# EAGLE design stm32l100r_ucboard (EAGLE 9.6.2)
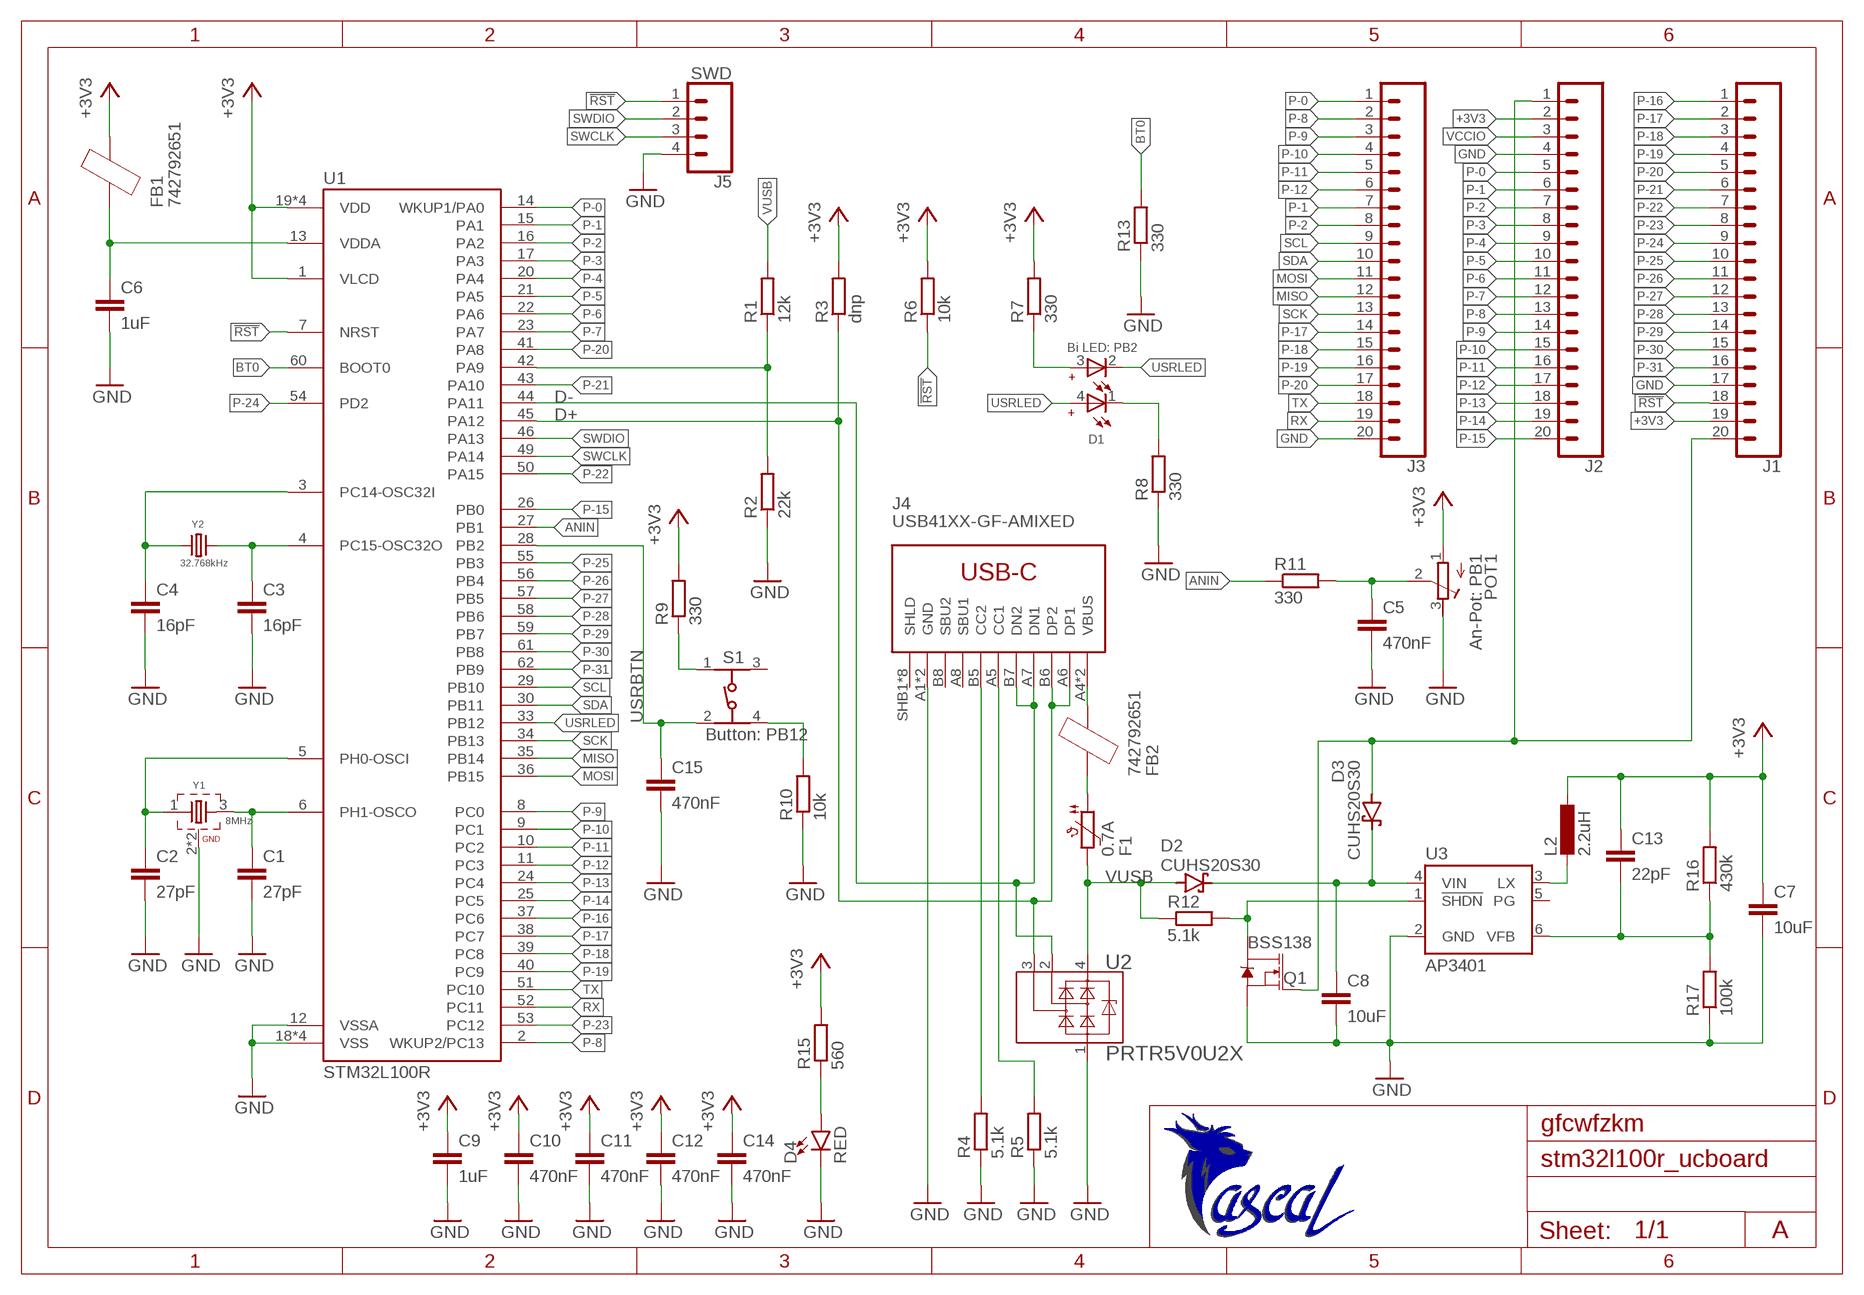
[diagram p0: schematic, sheet 1]

## Parts
C1  27pF  C-EUC0603  [C0603]
C2  27pF  C-EUC0603  [C0603]
C3  16pF  C-EUC0603  [C0603]
C4  16pF  C-EUC0603  [C0603]
C5  470nF  C-EUC0603  [C0603]
C6  1uF  C-EUC0603  [C0603]
C7  10uF  C-EUC0603  [C0603]
C8  10uF  C-EUC0603  [C0603]
C9  1uF  C-EUC0603  [C0603]
C10  470nF  C-EUC0603  [C0603]
C11  470nF  C-EUC0603  [C0603]
C12  470nF  C-EUC0603  [C0603]
C13  22pF  C-EUC0603  [C0603]
C14  470nF  C-EUC0603  [C0603]
C15  470nF  C-EUC0603  [C0603]
D1  Bi LED: PB2  WL-SBCD_0805_150080RV54050  [WL-SBCD_0805]
D2  CUHS20S30  [US2H]
D3  CUHS20S30  [US2H]
D4  RED  LED-RED0603  [LED-0603]
F1  0.7A  PTC_FUSE0805  [R0805]
FB1  742792651  FERRITE_BEAD  [R0603]
FB2  742792651  FERRITE_BEAD  [R0603]
J1  CONN_20  [1X20]
J2  CONN_20  [1X20]
J3  CONN_20  [1X20]
J4  USB41XX-GF-AMIXED  [USB4105-GF-A]
J5  SWD  CONN_04LOCK  [1X04_LOCK]
L2  2.2uH  L1210  [R1210]
POT1  An-Pot: PB1  RPOT-3386P  [3386P]
Q1  BSS138  MOSFET-NCH-BSS138  [SOT23-3]
R1  12k  R-EU_R0603  [R0603]
R2  22k  R-EU_R0603  [R0603]
R3  dnp  R-EU_R0603  [R0603]
R4  5.1k  R-EU_R0603  [R0603]
R5  5.1k  R-EU_R0603  [R0603]
R6  10k  R-EU_R0603  [R0603]
R7  330  R-EU_R0603  [R0603]
R8  330  R-EU_R0603  [R0603]
R9  330  R-EU_R0603  [R0603]
R10  10k  R-EU_R0603  [R0603]
R11  330  R-EU_R0603  [R0603]
R12  5.1k  R-EU_R0603  [R0603]
R13  330  R-EU_R0603  [R0603]
R15  560  R-EU_R0603  [R0603]
R16  430k  R-EU_R0603  [R0603]
R17  100k  R-EU_R0603  [R0603]
S1  Button: PB12  434153017835  [434153017835]
U1  STM32L100R  [LQFP-ST-64-2]
U2  PRTR5V0U2X  [SOT143B]
U3  AP3401  [TSOT23-6]
U$1  LOGO_PASCAL_GESELL10MM  [LOGO_10MM]
Y1  8MHz  WE-XTAL_CFPX-104_830106162701  [WE-XTAL_CFPX-104]
Y2  32.768kHz  WE-XTAL_CFPX-56_830025159  [WE-XTAL_CFPX-56]

## Nets
!RST: J1.18 J5.1 R6.1 U1.7(NRST)
!SHDN: Q1.3(D) R12.2 U3.1(!SHDN)
+3V3: C7.1 C9.1 C10.1 C11.1 C12.1 C13.1 C14.1 FB1.2 J1.19 J2.2 L2.1 POT1.1(A) R3.2 R6.2 R7.2 R9.2 R15.2 R16.2 U1.1(VLCD) U1.19(VDD) U1.32(VDD) U1.48(VDD) U1.64(VDD)
ANIN: R11.1 U1.27(PB1)
BT0: R13.2 U1.60(BOOT0)
D+: J4.A6(DP1) J4.B6(DP2) R3.1 U1.45(PA12) U2.3
D-: J4.A7(DN1) J4.B7(DN2) U1.44(PA11) U2.2
GND: C1.2 C2.2 C3.2 C4.2 C5.2 C6.2 C7.2 C8.2 C9.2 C10.2 C11.2 C12.2 C14.2 C15.2 D4.C J1.17 J2.4 J3.20 J4.A1(GND) J4.B1(GND) J5.4 POT1.3(E) Q1.2(S) R2.1 R4.1 R5.1 R8.1 R10.1 R13.1 R17.1 U1.12(VSSA) U1.18(VSS) U1.31(VSS) U1.47(VSS) U1.63(VSS) U2.1 U3.2(GND) Y1.2(GND) Y1.4(GND)
LX: L2.2 U3.3(LX)
MISO: J3.12 U1.35(PB14)
MOSI: J3.11 U1.36(PB15)
N$1: C4.1 U1.3(PC14-OSC32I) Y2.1
N$2: C3.1 U1.4(PC15-OSC32O) Y2.2
N$3: C2.1 U1.5(PH0-OSCI) Y1.1
N$4: C1.1 U1.6(PH1-OSCO) Y1.3
N$5: C6.1 FB1.1 U1.13(VDDA)
N$6: D1.3(G+) R7.1
N$7: J4.B5(CC2) R4.2
N$8: J4.A5(CC1) R5.2
N$9: F1.1 FB2.1
N$10: D1.1(R-) R8.2
N$11: R9.1 S1.1
N$12: R10.2 S1.4
N$14: C5.1 POT1.2(S) R11.2
N$19: D3.A J1.20 J2.1 Q1.1(G)
N$21: R1.1 R2.2 U1.42(PA9)
N$39: D4.A R15.1
P-0: J2.5 J3.1 U1.14(WKUP1/PA0)
P-1: J2.6 J3.7 U1.15(PA1)
P-2: J2.7 J3.8 U1.16(PA2)
P-3: J2.8 U1.17(PA3)
P-4: J2.9 U1.20(PA4)
P-5: J2.10 U1.21(PA5)
P-6: J2.11 U1.22(PA6)
P-7: J2.12 U1.23(PA7)
P-8: J2.13 J3.2 U1.2(WKUP2/PC13)
P-9: J2.14 J3.3 U1.8(PC0)
P-10: J2.15 J3.4 U1.9(PC1)
P-11: J2.16 J3.5 U1.10(PC2)
P-12: J2.17 J3.6 U1.11(PC3)
P-13: J2.18 U1.24(PC4)
P-14: J2.19 U1.25(PC5)
P-15: J2.20 U1.26(PB0)
P-16: J1.1 U1.37(PC6)
P-17: J1.2 J3.14 U1.38(PC7)
P-18: J1.3 J3.15 U1.39(PC8)
P-19: J1.4 J3.16 U1.40(PC9)
P-20: J1.5 J3.17 U1.41(PA8)
P-21: J1.6 U1.43(PA10)
P-22: J1.7 U1.50(PA15)
P-23: J1.8 U1.53(PC12)
P-24: J1.9 U1.54(PD2)
P-25: J1.10 U1.55(PB3)
P-26: J1.11 U1.56(PB4)
P-27: J1.12 U1.57(PB5)
P-28: J1.13 U1.58(PB6)
P-29: J1.14 U1.59(PB7)
P-30: J1.15 U1.61(PB8)
P-31: J1.16 U1.62(PB9)
RX: J3.19 U1.52(PC11)
SCK: J3.13 U1.34(PB13)
SCL: J3.9 U1.29(PB10)
SDA: J3.10 U1.30(PB11)
SWCLK: J5.3 U1.49(PA14)
SWDIO: J5.2 U1.46(PA13)
TX: J3.18 U1.51(PC10)
USRBTN: C15.1 S1.2 U1.28(PB2)
USRLED: D1.2(G-) D1.4(R+) U1.33(PB12)
VBUS: FB2.2 J4.A4(VBUS) J4.B4(VBUS)
VCCIO: J2.3
VFB: C13.2 R16.1 R17.2 U3.6(VFB)
VIN: C8.1 D2.C D3.C U3.4(VIN)
VUSB: D2.A F1.2 R1.2 R12.1 U2.4
Unconnected: J4.A8(SBU1) J4.B8(SBU2) J4.SHB1(SHLD) J4.SHB2(SHLD) J4.SHB3(SHLD) J4.SHB4(SHLD) J4.SHT1(SHLD) J4.SHT2(SHLD) J4.SHT3(SHLD) J4.SHT4(SHLD) S1.3 U3.5(PG)

## Notes on the sheet
- gfcwfzkm
- A

## Library data of the parts
C1-C15 = rcl:C-EU: CAPACITOR, European symbol; SPICEPREFIX: C
D1 = Wurth_LEDs_WL-SBCD:WL-SBCD_0805: WL-SBCD SMD Bi-color Chip LED Diffused Characteristics Two chips in one package Diffused lens Industry standard footprint High efficiency Low power consumption Wide viewing angle Thin, 0.5 mm height Packaged in standard tape and reel 7" Compatible with automatic placement machine Applications Backlighting applications Status indicator Front panel indicators Push button backlighting Symbol and switch backlighting <https://www.we-online.com/catalog/media/o165027v209%20Family_WL-SBCD_0805_150080xx54050.jpg> Details see: https://www.we-online.com/catalog/en/WL-SBCD/ Updated By Yingchun,Shan 2020-03-18 2020(C) Wurth Elektronik; ABSTRAHLWINKEL: 130°; DATASHEET-URL: https://www.we-online.com/catalog/datasheet/150080RV54050.pdf; EMITTING-COLOR: Red & Bright Green; PART-NUMBER: 150080RV54050
D2 D3 = Elektroniker MGB:CUHS: CUHSxx High Speed Schottky Barrier Diode Series With a Very Low Vf Voltage CUHS15F40 <https://toshiba.semicon-storage.com/info/docget.jsp?did=63603&prodName=CUHS15F40>, CUHS20S30 <https://toshiba.semicon-storage.com/info/docget.jsp?did=63606&prodName=CUHS20S30>, CUHS20S40 <https://toshiba.semicon-storage.com/info/docget.jsp?did=63610&prodName=CUHS20S40>, CUHS20F30 <https://toshiba.semicon-storage.com/info/docget.jsp?did=63604&prodName=CUHS20F30>, CUHS20F40 <https://toshiba.semicon-storage.com/info/docget.jsp?did=63600&prodName=CUHS20F40>
D4 = SparkFun-LED:LED-RED: Red SMD LED Used in manufacturing of most products at SparkFun Packages: 0603 - SMD 0603 package [Product Link] <http://docs.avagotech.com/docs/AV02-0551EN> 0603 SMART - SMD 0603 SMART package ( more efficient and expensive)[Product Link] <http://www.osram-os.com/Graphics/XPic2/00077099_0.pdf> 1206 - SMD1206 package [Product Link] <https://www.sparkfun.com/datasheets/DevTools/LilyPad/Q150OVS4.pdff> SparkFun Products: Pro Mini 328 -5V <https://www.sparkfun.com/products/821> RedBoard <https://www.sparkfun.com/products/12757> IOIO-OTG <https://www.sparkfun.com/products/13613>; PROD_ID: DIO-00819
F1 = Elektroniker MGB:PTC_FUSE
FB1 FB2 = Elektroniker MGB:FERRITE_BEAD
J1-J3 = SparkFun-Connectors:CONN_20: Multi connection point. Often used as Generic Header-pin footprint for 0.1 inch spaced/style header connections On any of the 0.1 inch spaced packages, you can populate with these: Break Away Headers - Straight <https://www.sparkfun.com/products/116> (PRT-00116) Break Away Male Headers - Right Angle <https://www.sparkfun.com/products/553> (PRT-00553) Female Headers <https://www.sparkfun.com/products/115> (PRT-00115) Break Away Headers - Machine Pin <https://www.sparkfun.com/products/117> (PRT-00117) Break Away Female Headers - Swiss Machine Pin <https://www.sparkfun.com/products/743> (PRT-00743) For SCREWTERMINALS and SPRING TERMINALS visit here: Screw Terimnals on SparkFun.com <https://www.sparkfun.com/search/results?term=Screw+Terminals> (5mm/3.5mm/2.54mm spacing) This device is also useful as a general connection point to wire up your design to another part of your project. Our various solder wires solder well into these plated through hole pads. Hook-Up Wire - Assortment (Stranded, 22 AWG) <https://www.sparkfun.com/products/11375> (PRT-11375) Hook-Up Wire - Assortment (Solid Core, 22 AWG) <https://www.sparkfun.com/products/11367> (PRT-11367) View the entire wire category on our website here <https://www.sparkfun.com/categories/141> Special notes: Molex polarized connector foot print use with SKU : PRT-08231 with associated crimp pins and housings. 1MM SMD Version SKU: PRT-10208 NOTES ON THE VARIANTS LOCK and LOCK_LONGPADS... This footprint was designed to help hold the alignment of a through-hole component (i.e. 6-pin header) while soldering it into place. You may notice that each hole has been shifted either up or down by 0.005 of an inch from it's more standard position (which is a perfectly straight line). This slight alteration caused the pins (the squares in the middle) to touch the edges of the holes. Because they are alternating, it causes a "brace" to hold the component in place. 0.005 has proven to be the perfect amount of "off-center" position when using our standard breakaway headers. Although looks a little odd when you look at the bare footprint, once you have a header in there, the alteration is very hard to notice. Also,if you push a header all the way into place, it is covered up entirely on the bottom side. Note about LOCK SPECIAL package: This is just like the LOCK variant in that the holes are staggared by 5 mil, but except for the last two holes. They are not altered from the "standard" footprint layout. This is used for a special purpose on the layout of our Graphic LCD Backpack. Make sure you want to use this device before selecting it for you project!
J4 = Pascal_Library:USB41XX-GF-A
J5 = SparkFun-Connectors:CONN_04: Multi connection point. Often used as Generic Header-pin footprint for 0.1 inch spaced/style header connections On any of the 0.1 inch spaced packages, you can populate with these: Break Away Headers - Straight <https://www.sparkfun.com/products/116> (PRT-00116) Break Away Male Headers - Right Angle <https://www.sparkfun.com/products/553> (PRT-00553) Female Headers <https://www.sparkfun.com/products/115> (PRT-00115) Break Away Headers - Machine Pin <https://www.sparkfun.com/products/117> (PRT-00117) Break Away Female Headers - Swiss Machine Pin <https://www.sparkfun.com/products/743> (PRT-00743) For SCREWTERMINALS and SPRING TERMINALS visit here: Screw Terimnals on SparkFun.com <https://www.sparkfun.com/search/results?term=Screw+Terminals> (5mm/3.5mm/2.54mm spacing) This device is also useful as a general connection point to wire up your design to another part of your project. Our various solder wires solder well into these plated through hole pads. Hook-Up Wire - Assortment (Stranded, 22 AWG) <https://www.sparkfun.com/products/11375> (PRT-11375) Hook-Up Wire - Assortment (Solid Core, 22 AWG) <https://www.sparkfun.com/products/11367> (PRT-11367) View the entire wire category on our website here <https://www.sparkfun.com/categories/141> Special notes: Molex polarized connector foot print use with SKU : PRT-08231 with associated crimp pins and housings. 1MM SMD Version SKU: PRT-10208; PROD_ID: CONN-09696
L2 = Pascal_Library:L
POT1 = Pascal_Library:RPOT-3386P
Q1 = SparkFun-DiscreteSemi:MOSFET-NCH: N-channel MOSFETs Voltage controlled devices that allow control of high current outputs. SparkFun Products: SparkFun OpenScale <https://www.sparkfun.com/products/13261> SparkFun Digital Sandbox <https://www.sparkfun.com/products/12651> SparkFun Monster Moto Shield <https://www.sparkfun.com/products/10182> SparkFun MOSFET Power Controller <https://www.sparkfun.com/products/11214>; PROD_ID: TRANS-00830; VALUE: 220mA/50V/3.5Ω
R1-R13 R15-R17 = rcl:R-EU_: RESISTOR, European symbol; SPICEPREFIX: R
S1 = Wurth_Switch_WS-TASV:434153017835: WS-TASV J-Bend SMT Tact Switch 3.5x2.9 mm Material Properties Cover Material : Stainless Steel Properties Actuator Material:LCP Actuator Flammability Rating:UL94 V-0 Actuator Color:Blue Frame Material:PA46 Frame Flammability Rating:UL94 HB Frame Color:Black Contact Material:Stainless Steel Contact Plating:Silver Terminal Material:Copper Alloy Terminal Plating:Silver VR:12 V (DC) Contact Resistance Initial:100 mΩ Contact Resistance After Life Test:1 Ω RISO:100 MΩ Withstanding Voltage:250 V (AC) Washable:No Qty.:4000 Mechanical Properties Stroke :0.15 mm General Information Operating Temperature:-40 up to +85 °C Washable:No Packaging Properties Packaging:Tape and Reel <https://www.we-online.com/catalog/media/o72753v209%20WS-TASU_434331013822_a_4C.jpg> Details see: https://www.we-online.com/catalog/en/TASV_3_5X2_9_SMD_J-BEND/ Updated by yingchun,Shan;2020-02-18 2020(C) Würth Elektronik; DATASHEET-URL: https://www.we-online.com/catalog/datasheet/434153017835.pdf; H: 1.7mm; OPERATION-FORCE: 350g; PART-NUMBER: 434153017835; QTY: 4000; VALUE: 434153017835
U1 = Pascal_Library:STM32L100R
U2 = Elektroniker MGB:PRTR5V0U2X: PRTR5V0U2X - Ultra low capacitance double rail-to-rail ESD protection diode Ultra low capacitance rail-to-rail ElectroStatic Discharge (ESD) protection diode in a small SOT143B Surface-Mounted Device (SMD) plastic package designed to protect two Hi-Speed data lines or high-frequency signal lines from the damage caused by ESD and other transients. PRTR5V0U2X incorporates two pairs of ultra low capacitance rail-to-rail diodes as well as an additional ESD protection diode to ensure signal line protection even if no supply voltage is available.
U3 = Pascal_Library:AP3401
U$1 = Pascal_Library:LOGO_PASCAL_GESELL: Mein Logo halt
Y1 = Wurth_Quartz Crystals & Oscillators_WE-XTAL:WE-XTAL_CFPX-104: WE-XTAL Quartz Crystal Characteristics SMT and THT models Hermetically sealed Frequencies between 1.8432 MHz and 50 MHz Tolerances down to ±10 ppm available Maximum operating temperatures range: -40 °C to 85 °C Stabilities down to ±10 ppm available Applications Microprocessor Wireless Communication Devices Industrial Devices Wired Communication (e.g. Ethernet and USB) IoT Optical Network Audio and Multimedia Devices Test and Measurement Equipment Navigation and Locators Wearables <https://www.we-online.com/catalog/media/o135919v209%20Family_WE-XTAL_IQXC-42.jpg> Details see: https://www.we-online.com/catalog/en/WE-XTAL Updated by Ella Wu , 2020-11-23 2020 (C) Wurth Elektronik; C-LOAD: 16pF; DATASHEET-URL: https://www.we-online.com/catalog/datasheet/830106162701.pdf; MOUNT: SMT; PART-NUMBER: 830106162701; STABILITY: 30ppm; TOLERANCE: ±20ppm
Y2 = Wurth_Quartz Crystals & Oscillators_WE-XTAL:WE-XTAL_CFPX-56: WE-XTAL Watch Crystals Characteristics SMT and THT models Hermetically sealed Frequency: 32.768 kHz Tolerances down to ±10 ppm available Characteristics Microprocessor Real Time Clocks Test and Measurement Equipment Battery powered Applications <https://www.we-online.com/catalog/media/o162740v209%20Family_WE-XTAL_WatchCrystal.jpg> Details see: https://www.we-online.com/catalog/en/WE-XTAL_WATCHCRYSTAL Updated by Ella Wu, 2020-10-30 2020 (C) Wurth Elektronik; C-LOAD: 12.5pF; DATASHEET-URL: https://www.we-online.com/catalog/datasheet/830025159.pdf; MOUNT: SMT; PART-NUMBER: 830025159; TOLERANCE: ±20ppm

## Board
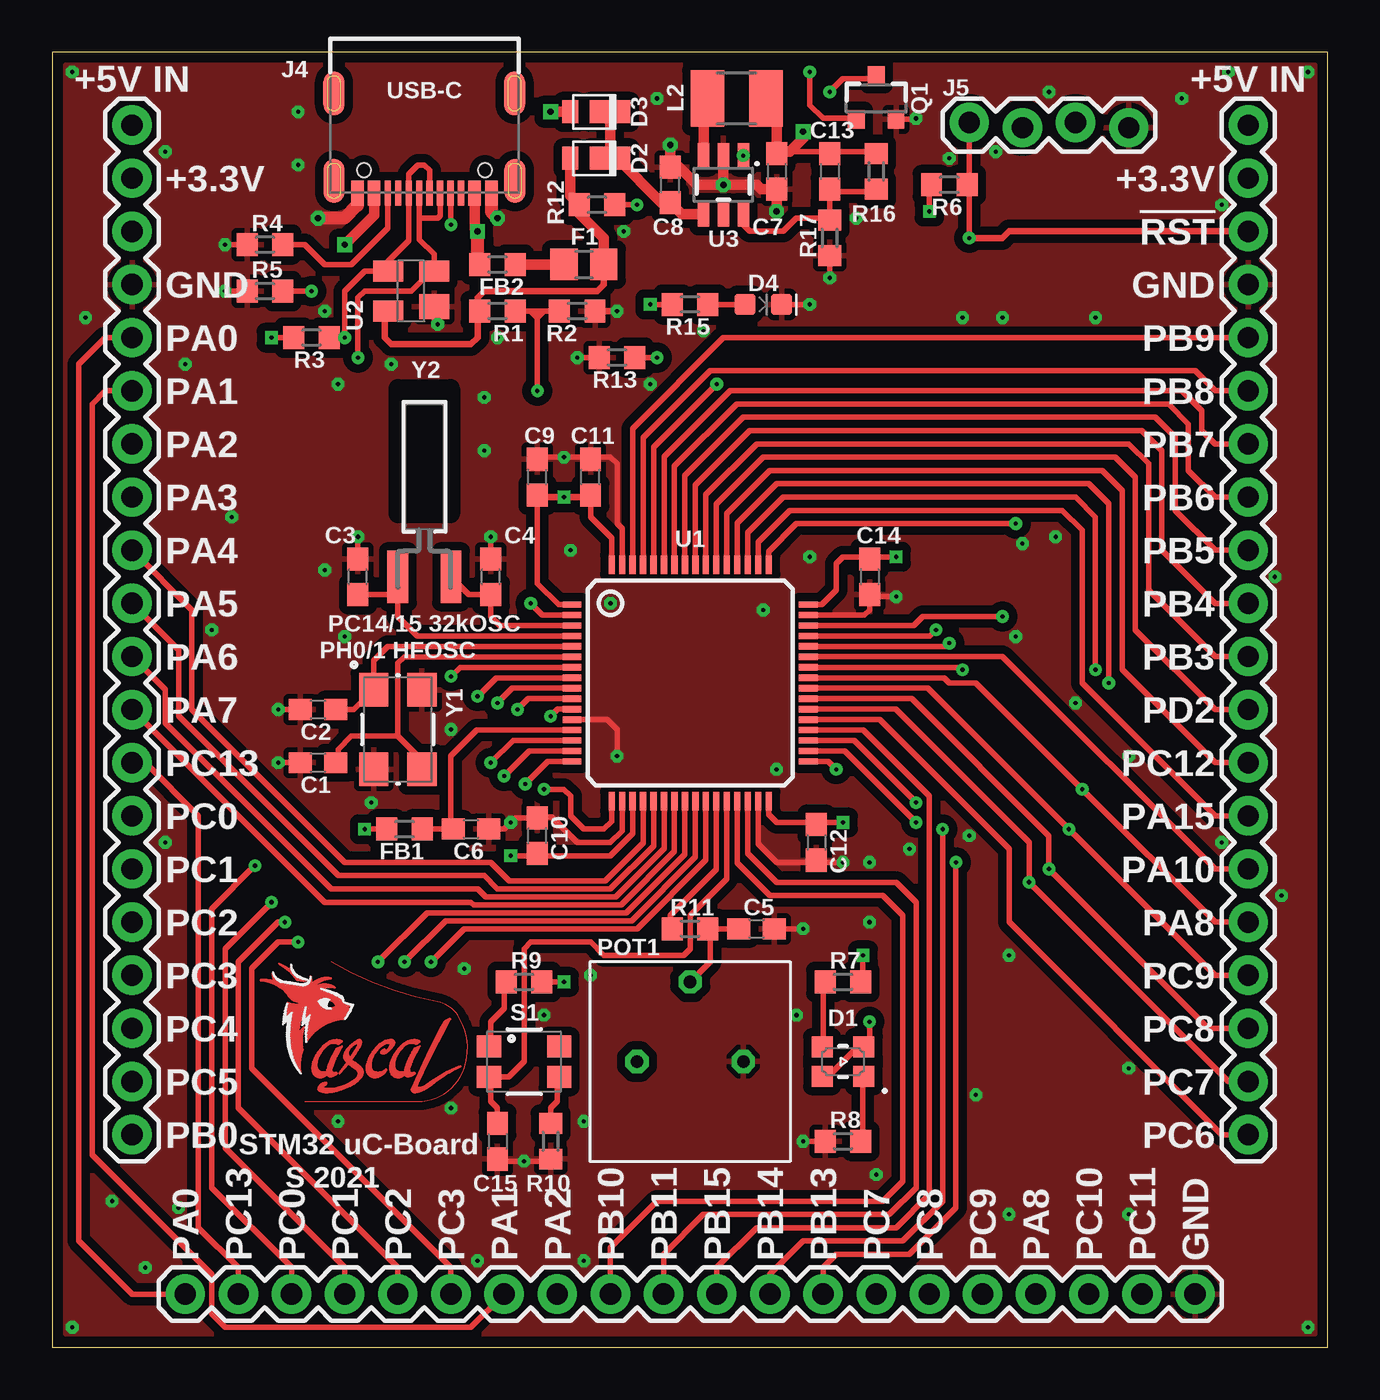
[diagram p1: board, top side]
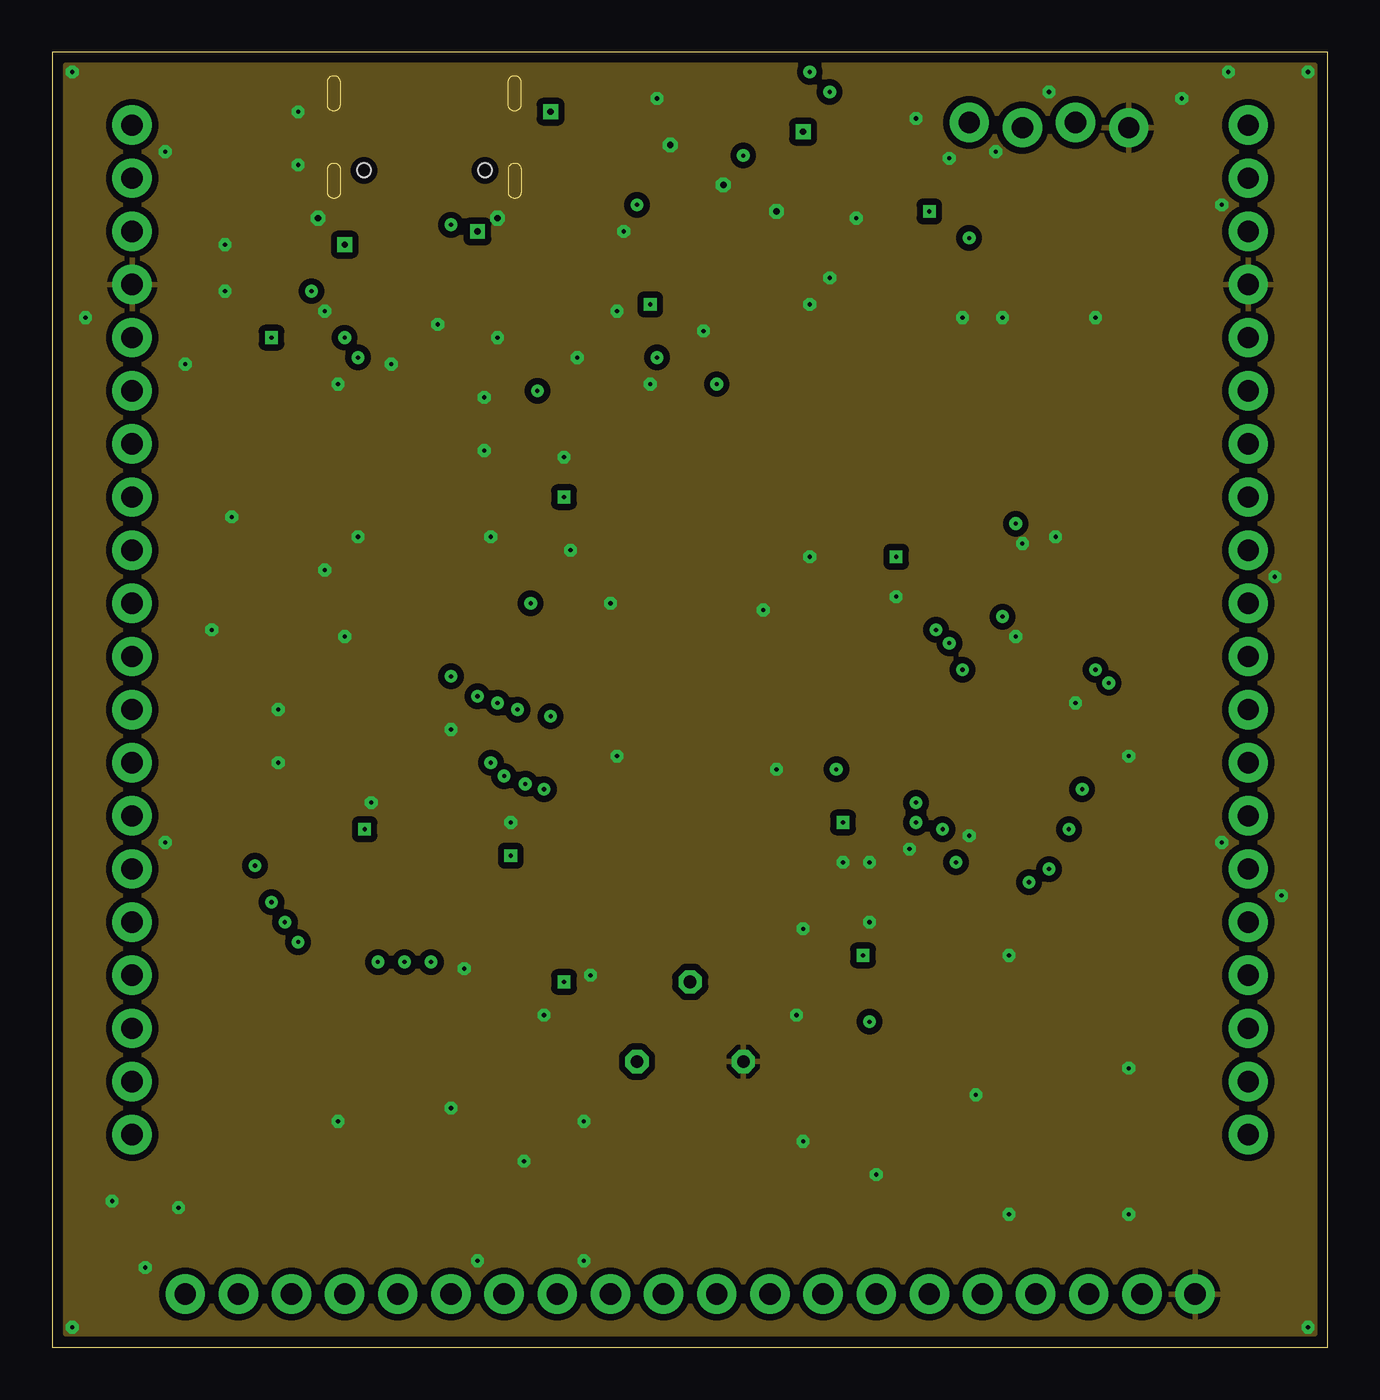
[diagram p2: board, inner layer Route2]
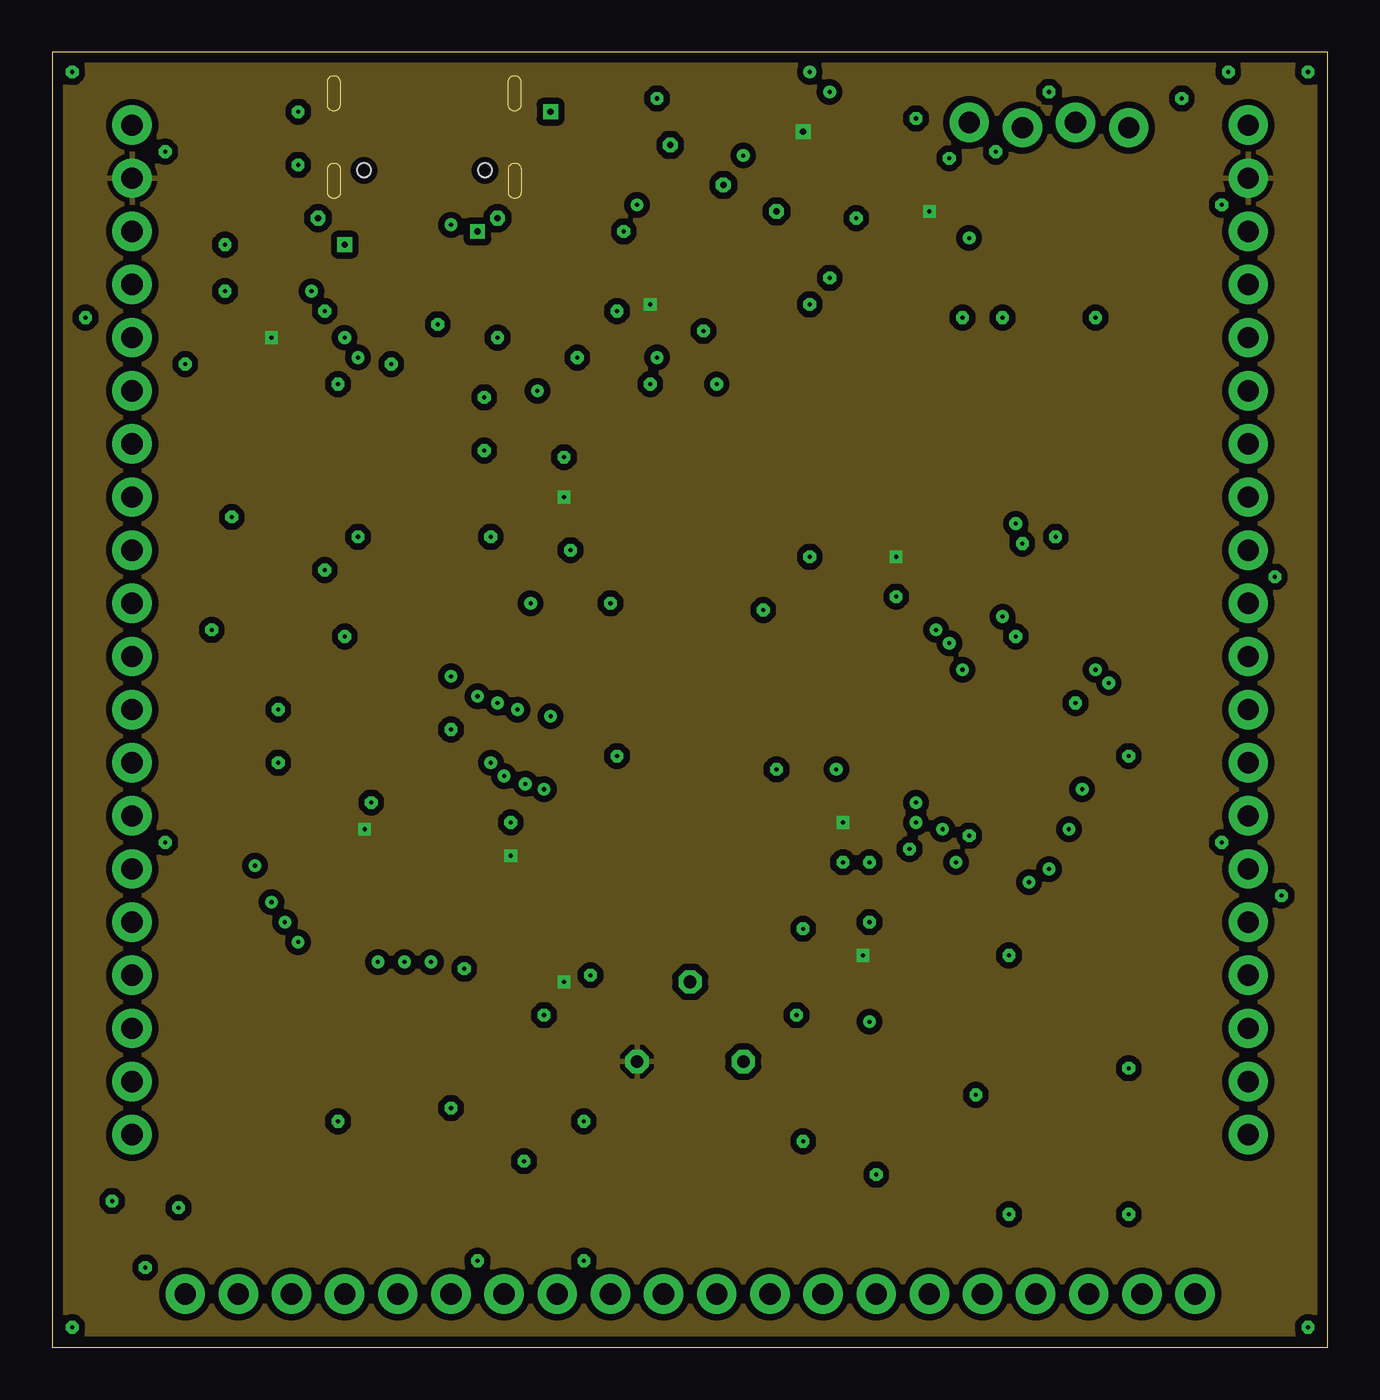
[diagram p3: board, inner layer Route15]
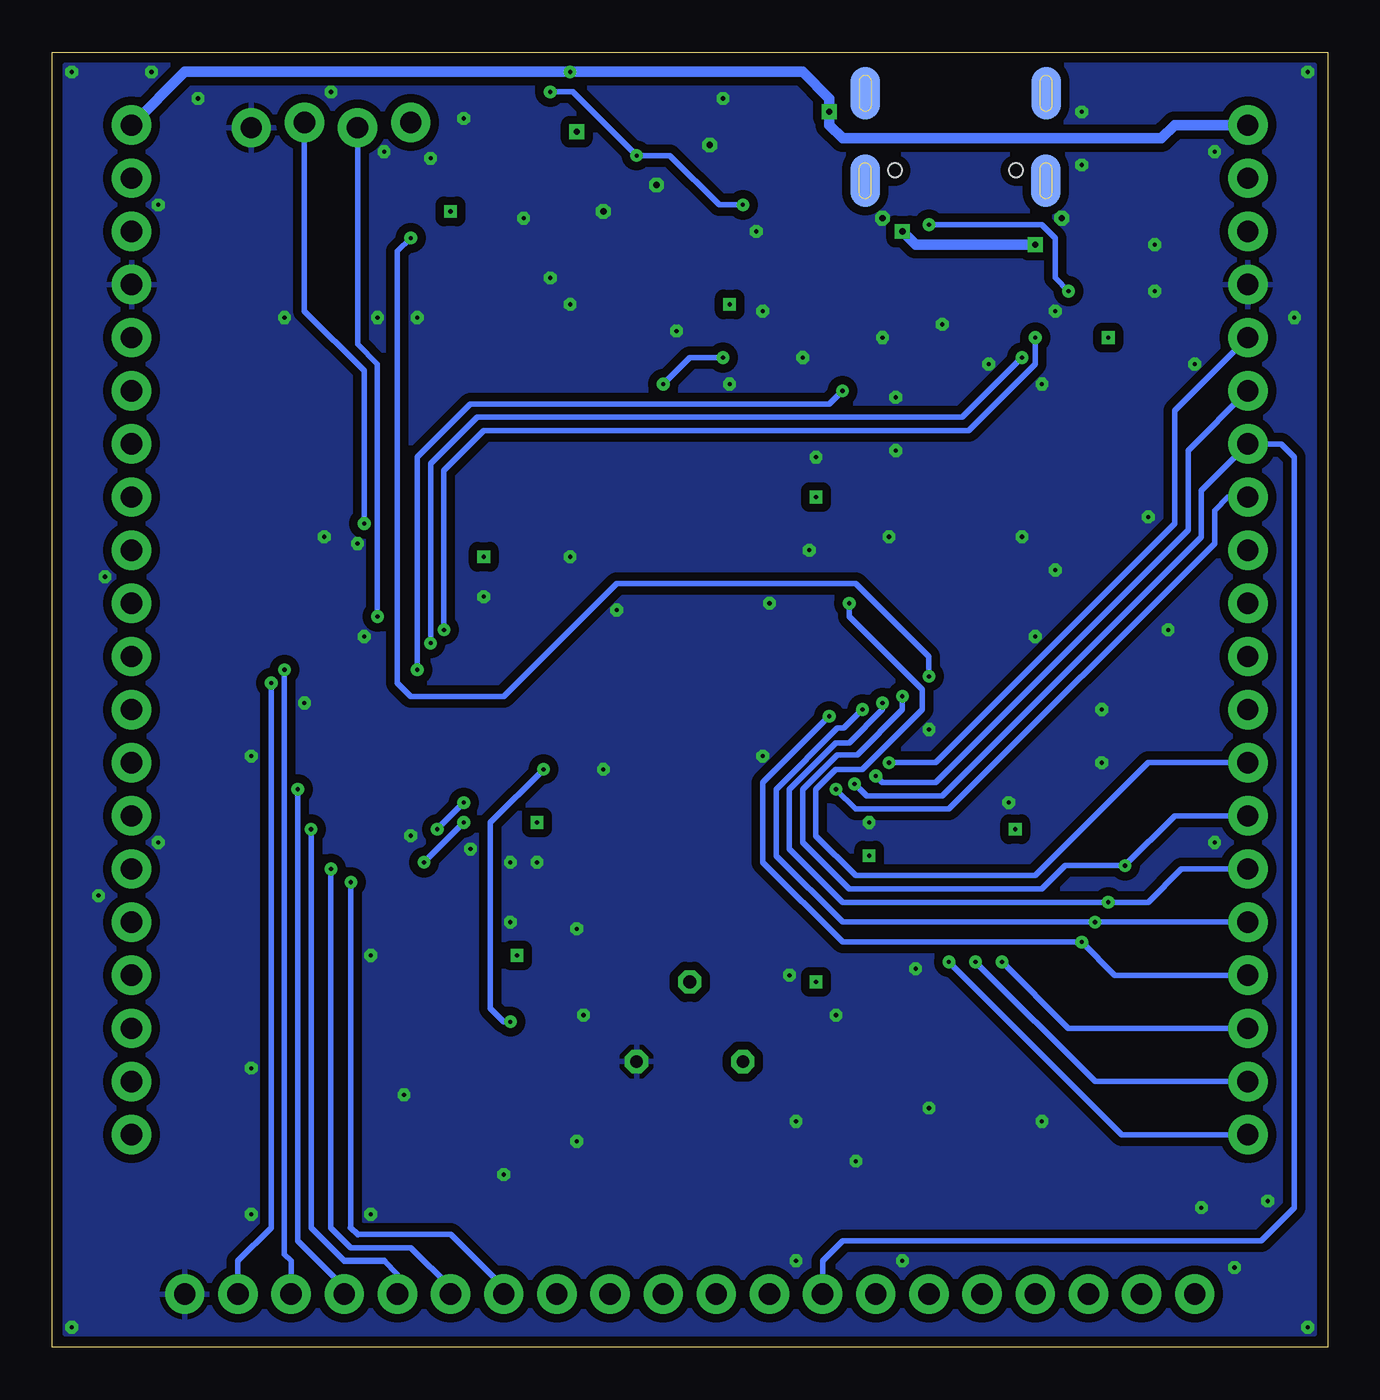
[diagram p4: board, bottom side, seen from below]

Size 60.94 x 61.9 mm. Coordinates in mm from the lower left corner, seen from the top.
Outline: 0,0 60.94,0 60.94,61.9 0,61.9 0,0
Copper layers (1+2*15+16): Top 0.035mm / dielectric 0.2mm / Route2 0.035mm / dielectric 1mm / Route15 0.035mm / dielectric 0.2mm / Bottom 0.035mm
Design rules "jlcpcb_4_layers": minimum track width 5mil, minimum drill 0.2mm, track to track 5mil, track to pad 6mil, pad to pad 6mil, via to via 6mil, smd to smd 6mil, copper to edge 0mil, drill to drill 6mil, minimum pad ring 10mil, minimum via ring 8mil, stop-mask expansion 4mil, vias tented up to drill 0mil, thermal gap 10mil

### Footprints (pad centres in the part's own frame; a part is rotated, then mirrored left to right if it is on the bottom)
C0603 = smd 1.1 x 1: 1 -0.85,0; 2 0.85,0
WL-SBCD_0805 = smd 1 x 1: 1 -1,0.7; 2 -1,-0.7; 3 1,-0.7; 4 1,0.7
US2H = smd 0.8 x 1.1: A 0.65,0 | smd 2 x 1.1: C -1.25,0
LED-0603 = smd 1 x 1: A -0.877,0; C 0.877,0
R0805 = smd 1.3 x 1.5: 1 -0.95,0; 2 0.95,0
R0603 = smd 1 x 1.1: 1 -0.85,0; 2 0.85,0
1X20 = drill 1.016 pad 1.88: 1 0,0; 2 2.54,0; 3 5.08,0; 4 7.62,0; 5 10.16,0; 6 12.7,0; 7 15.24,0; 8 17.78,0; 9 20.32,0; 10 22.86,0; 11 25.4,0; 12 27.94,0; 13 30.48,0; 14 33.02,0; 15 35.56,0; 16 38.1,0; 17 40.64,0; 18 43.18,0; 19 45.72,0; 20 48.26,0
USB4105-GF-A = smd 0.6 x 1.2: A1 -3.2,4.53; A4 -2.4,4.53; B1 3.2,4.53; B4 2.4,4.53 | smd 0.3 x 1.2: A5 -1.25,4.53; A6 -0.25,4.53; A7 0.25,4.53; A8 1.25,4.53; B5 1.75,4.53; B6 0.75,4.53; B7 -0.75,4.53; B8 -1.75,4.53 | smd 1.4 x 2.5 bottom: SHB1 -4.32,3.93; SHB2 -4.31,-0.25; SHB3 4.32,3.93; SHB4 4.33,-0.25 | smd 1 x 2.1: SHT1 -4.32,3.93; SHT2 -4.31,-0.25; SHT3 4.32,3.93; SHT4 4.33,-0.25 | hole 0.65: -2.89,3.43; 2.89,3.43
1X04_LOCK = drill 1.016 pad 1.88: 1 0,0.127; 2 2.54,-0.127; 3 5.08,0.127; 4 7.62,-0.127
R1210 = smd 1.6 x 2.7: 1 -1.4,0; 2 1.4,0
3386P = drill 0.6 octagon: 1 2.54,0; 2 0,-3.81; 3 -2.54,0
SOT23-3 = smd 0.8 x 0.9: 1 -0.95,-1; 2 0.95,-1; 3 0,1.1
434153017835 = smd 1.15 x 1.05: 1 -1.675,0.725; 2 -1.675,-0.725; 3 1.675,0.725; 4 1.675,-0.725
LQFP-ST-64-2 = smd 0.9 x 0.3: 1 -5.65,3.75; 2 -5.65,3.25; 3 -5.65,2.75; 4 -5.65,2.25; 5 -5.65,1.75; 6 -5.65,1.25; 7 -5.65,0.75; 8 -5.65,0.25; 9 -5.65,-0.25; 10 -5.65,-0.75; 11 -5.65,-1.25; 12 -5.65,-1.75; 13 -5.65,-2.25; 14 -5.65,-2.75; 15 -5.65,-3.25; 16 -5.65,-3.75; 33 5.65,-3.75; 34 5.65,-3.25; 35 5.65,-2.75; 36 5.65,-2.25; 37 5.65,-1.75; 38 5.65,-1.25; 39 5.65,-0.75; 40 5.65,-0.25; 41 5.65,0.25; 42 5.65,0.75; 43 5.65,1.25; 44 5.65,1.75; 45 5.65,2.25; 46 5.65,2.75; 47 5.65,3.25; 48 5.65,3.75 | smd 0.3 x 0.9: 17 -3.75,-5.65; 18 -3.25,-5.65; 19 -2.75,-5.65; 20 -2.25,-5.65; 21 -1.75,-5.65; 22 -1.25,-5.65; 23 -0.75,-5.65; 24 -0.25,-5.65; 25 0.25,-5.65; 26 0.75,-5.65; 27 1.25,-5.65; 28 1.75,-5.65; 29 2.25,-5.65; 30 2.75,-5.65; 31 3.25,-5.65; 32 3.75,-5.65; 49 3.75,5.65; 50 3.25,5.65; 51 2.75,5.65; 52 2.25,5.65; 53 1.75,5.65; 54 1.25,5.65; 55 0.75,5.65; 56 0.25,5.65; 57 -0.25,5.65; 58 -0.75,5.65; 59 -1.25,5.65; 60 -1.75,5.65; 61 -2.25,5.65; 62 -2.75,5.65; 63 -3.25,5.65; 64 -3.75,5.65
SOT143B = smd 1.2 x 1.44: 1 -0.75,-1.1 | smd 1 x 1.44: 2 0.95,-1.1; 3 0.95,1.1; 4 -0.95,1.1
TSOT23-6 = smd 0.55 x 1.2: 1 -0.95,-1.4; 2 0,-1.4; 3 0.95,-1.4; 4 0.95,1.4; 5 0,1.4; 6 -0.95,1.4
WE-XTAL_CFPX-104 = smd 1.6 x 1.4: 1 -1.9,-1.15; 2 1.9,-1.15; 3 1.9,1.15; 4 -1.9,1.15
WE-XTAL_CFPX-56 = smd 2.5 x 1: 1 0,1.27; 2 0,-1.27

### Placement (x,y rotation side)
C1  12.7,27.94 180 top
C2  12.7,30.48 180 top
C3  14.61,36.83 90 top
C4  20.95,36.83 90 top
C5  33.66,20 0 top
C6  20,24.77 0 top
C7  34.61,56.2 270 top
C8  29.53,55.56 90 top
C9  23.18,41.59 90 top
C10  23.18,24.45 90 top
C11  25.72,41.59 90 top
C12  36.51,24.13 270 top
C13  37.15,56.2 270 top
C14  39.05,36.83 270 top
C15  21.27,9.84 270 top
D1  37.78,13.65 180 top
D2  25.4,56.83 180 top
D3  25.4,59.05 180 top
D4  33.97,49.85 0 top
F1  25.4,51.75 0 top
FB1  16.83,24.77 180 top
FB2  21.27,51.75 180 top
J1  57.15,10.16 90 top
J2  3.81,58.42 270 top
J3  6.35,2.54 0 top
J4  17.78,59.69 180 top
J5  43.81,58.42 0 top
L2  32.7,59.69 180 top
POT1  30.48,13.65 180 top
Q1  39.37,59.69 0 top
R1  21.27,49.53 180 top
R2  25.08,49.53 180 top
R3  12.38,48.26 180 top
R4  10.16,52.7 0 top
R5  10.16,50.48 0 top
R6  42.86,55.56 180 top
R7  37.78,17.46 0 top
R8  37.78,9.84 0 top
R9  22.54,17.46 0 top
R10  23.81,9.84 90 top
R11  30.48,20 0 top
R12  26.04,54.61 0 top
R13  26.99,47.31 0 top
R15  30.48,49.85 180 top
R16  39.37,56.2 90 top
R17  37.15,53.02 90 top
S1  22.54,13.65 0 top
U1  30.48,31.75 0 top
U2  17.14,50.48 90 top
U3  32.07,55.56 180 top
U$1  9.21,11.11 0 top
Y1  16.51,29.53 270 top
Y2  17.78,36.83 270 top

### Tracks (layer width: path | path; a pad name or v marks a point on that pad's centre or on a via)
!RST  (via drill 0.2)
  Top 0.254: U1.7 19.48,32.5 v19.05,32.07 | v43.81,53.02 43.81,55.46 R6.1 43.81,55.66 J5.1
  Top 0.305: J1.18 45.72,53.34 45.4,53.02 v43.81,53.02
  Bottom 0.254: v19.05,32.07 19.05,33.02 22.54,36.51 33.97,36.51 39.37,31.11 43.81,31.11 44.45,31.75 44.45,52.39 v43.81,53.02
!SHDN  (via drill 0.2)
  Top 0.254: Q1.3 39.22,60.64 37.78,60.64 v37.15,60.01 | R12.2 v27.94,54.61
  Bottom 0.254: v37.15,60.01 36.06,60.01 U3.1 31.43,56.96 29.08,54.61 v27.94,54.61
  other vias: 33.02,56.96
+3V3  (via drill 0.2, 0.3)
  Top 0.254: U1.48 36.77,35.5 37.47,36.2 37.47,37.47 37.78,37.78 38.95,37.78 C14.1 39.16,37.78 v40.32,37.78 | U1.32 34.23,25.46 34.61,25.08 36.41,25.08 C12.1 36.62,25.08 v37.78,25.08 | U1.19 27.73,24.55 26.67,23.5 23.28,23.5 C10.1 23.07,23.5 v21.91,23.5 | U1.64 26.73,38.67 25.72,39.69 C11.1 | U1.1 24.19,35.5 23.18,36.51 C9.1 | FB1.2 v14.92,24.77 | R16.2 39.27,57.15 37.25,57.15 | 37.25,57.15 C13.1 | 34.71,57.15 37.25,57.15 | R6.2 41.91,55.46 v41.91,54.29 | R15.2 v28.57,49.85 | R7.2 38.73,17.57 v38.73,18.73 | R9.2 v24.45,17.46 | R3.2 v10.48,48.26
  Top 0.305: C9.1 23.28,40.64 v24.45,40.64 25.61,40.64 C11.1
  Top 0.508: L2.1 34.61,59.19 C7.1 34.71,57.15 35.24,57.15 35.88,57.78 v35.88,58.1 | 37.05,57.15 C13.1
  pour Route15 (isolate 0.305): 0.64,61.28 0.64,0.64 60.33,0.64 60.33,61.28
ANIN
  Top 0.254: U1.27 31.73,22.84 29.53,20.64 29.53,20.11 R11.1
BT0  (via drill 0.2)
  Top 0.254: U1.60 28.73,43.02 v31.75,46.04 | R13.2 v28.89,47.31
  Bottom 0.254: v31.75,46.04 30.48,47.31 v28.89,47.31
D+  (via drill 0.2)
  Top 0.254: U2.3 16.05,51.92 17.03,52.91 J4.B6 17.03,56.08 17.46,56.52 17.78,56.52 18.03,56.27 J4.A6 | U2.3 | U1.45 41.94,34 v42.23,34.29 | U2.3 14.92,51.44 13.97,50.48 v13.97,48.26 R3.1
  Bottom 0.254: v42.23,34.29 42.23,41.91 40.32,43.81 17.14,43.81 13.97,46.99 v13.97,48.26
D-  (via drill 0.2)
  Top 0.254: J4.A7 17.53,53.98 | 17.53,53.98 17.53,52.95 18.25,52.24 U2.2 18.09,51.43 17.14,50.48 14.92,50.48 14.61,50.16 v14.61,47.31 | J4.B7 18.53,54.09 18.41,53.98 17.53,53.98 | U1.44 42.71,33.5 v42.86,33.66
  Bottom 0.254: v42.86,33.66 42.86,42.23 40.64,44.45 17.46,44.45 v14.61,47.31
GND  (via drill 0.2, 0.3)
  Top 0.254: U1.47 38.81,35 39.05,35.24 C14.2 39.16,35.88 v40.32,35.88 | U1.31 33.73,24.05 34.61,23.18 36.41,23.18 C12.2 36.62,23.18 v37.78,23.18 | C15.2 21.38,8.89 v22.54,8.89 23.71,8.89 R10.1 | 23.28,25.4 23.23,25.35 | 23.23,25.35 C10.2 22.12,25.3 v21.91,25.08 21.59,24.77 C6.2 20.95,24.87 | U1.18 27.23,24.69 26.67,24.13 25.08,24.13 23.86,25.35 23.23,25.35 | U1.63 27.23,39.13 26.99,39.37 26.99,42.23 26.67,42.55 25.82,42.55 C11.2 25.61,42.55 v24.45,42.55 23.28,42.55 C9.2 | Q1.2 41.23,58.69 v41.27,58.74 | D4.C v36.2,49.85 | R17.1 v37.15,51.12 | R13.1 v25.08,47.31 | C4.2 v20.95,38.73 | C3.2 v14.61,38.73 | C1.2 v10.79,27.94 | C2.2 v10.79,30.48 | C5.2 v35.88,20 | R8.1 v35.88,9.84 | U2.1 18.25,49.06 v18.41,48.9 | R4.1 v8.26,52.7 | R5.1 v8.26,50.48 | U1.12 26.52,30 26.99,29.53 v26.99,28.26
  Top 0.305: R2.1 v26.99,49.53
  Top 0.508: U3.2 v32.07,55.56 | v32.07,55.56 30.8,55.56 29.95,56.41 C8.2 v29.53,57.47 | v32.07,55.56 33.66,55.56 33.87,55.35 C7.2 v34.61,54.29
  Top 0.61: J4.A1 20.98,54.27 v21.27,53.98 | J4.B1 14.58,54.59 13.97,53.98 v12.7,53.98
  other vias: 0.95,0.95 4.45,3.81 2.86,6.99 6.03,6.67 5.4,24.13 8.57,39.69 7.62,34.29 0.95,60.96 11.75,59.05 5.4,57.15 11.75,56.52 1.59,49.21 6.35,46.99 13.65,46.04 13.02,37.15 20.64,42.86 20.64,45.4 21.27,48.26 16.19,46.99 13.02,49.53 28.57,46.04 31.11,48.58 27.3,53.34 60.01,60.96 56.2,60.96 53.98,59.69 55.88,54.61 28.89,59.69 38.42,53.98 43.5,49.21 45.4,49.21 45.09,57.15 47.62,60.01 42.86,56.83 24.77,38.1 26.67,35.56 33.97,35.24 34.61,27.62 39.05,23.18 40.96,23.81 43.81,24.45 39.05,20.32 45.72,18.73 45.72,6.35 60.01,0.95 39.37,8.26 20.32,4.13 25.4,4.13 13.65,10.79 19.68,18.1 25.72,17.78 23.5,15.88 19.05,11.43 25.4,10.79 35.56,15.88 44.13,12.06 51.44,13.34 51.44,6.35 51.44,28.26 55.88,24.13 48.9,30.8 47.94,38.73 46.04,33.97 46.35,38.42 49.85,49.21 58.74,21.59 58.42,36.83 19.05,29.53 13.97,33.97 15.24,26.04 36.2,37.78
  pour Route2 (isolate 0.305): 0.64,61.28 60.33,61.28 60.33,59.69 60.33,0.64 4.13,0.64 0.64,0.64
  pour Top (isolate 0.406): 0.64,61.28 0.64,0.64 60.33,0.64 60.33,61.28
  pour Bottom (isolate 0.406): 0.64,61.28 0.64,0.64 60.33,0.64 60.33,61.28
LX
  Top 0.508: U3.3 31.12,59.51 L2.2
MISO  (via drill 0.2)
  Top 0.254: J3.12 34.29,3.49 35.88,5.08 40.64,5.08 42.55,6.99 v42.55,24.77 | U1.35 38.31,29 v41.27,26.04
  Bottom 0.254: v41.27,26.04 v42.55,24.77
MOSI
  Top 0.254: J3.11 31.75,3.81 33.66,5.71 40.32,5.71 41.91,7.3 41.91,26.35 38.76,29.5 U1.36
N$1
  Top 0.254: U1.3 21.38,34.5 20.95,34.92 C4.1 19.9,35.98 Y2.1
N$2
  Top 0.254: U1.4 17.43,34 16.51,34.92 16.51,35.88 | 16.51,35.88 Y2.2 | C3.1 16.41,35.98 16.51,35.88
N$3
  Top 0.254: U1.5 16.04,33.5 15.36,32.82 Y1.1 14.41,30.48 C2.1
N$4
  Top 0.254: U1.6 16.81,33 16.51,32.7 16.51,29.21 | C1.1 13.65,28.04 13.65,28.57 14.29,29.21 16.51,29.21 | Y1.3 17.66,28.06 16.51,29.21
N$5
  Top 0.254: U1.13 20.29,29.5 19.05,28.26 19.05,24.87 C6.1 FB1.1
N$6
  Top 0.254: R7.1 36.83,17.36 36.83,14.4 D1.3
N$7
  Top 0.254: J4.B5 16.03,53.49 14.29,51.75 13.02,51.75 12.06,52.7 R4.2
N$8  (via drill 0.2)
  Top 0.254: J4.A5 19.03,53.68 v19.05,53.66 | v12.38,50.48 R5.2
  Bottom 0.254: v19.05,53.66 13.65,53.66 13.02,53.02 13.02,51.12 v12.38,50.48
N$9
  Top 0.508: FB2.1 F1.1
N$10
  Top 0.254: R8.2 38.73,9.95 38.73,12.9 D1.1
N$11
  Top 0.254: R9.1 21.59,17.36 21.59,16.19 20.95,15.56 20.95,14.46 S1.1
N$12
  Top 0.254: S1.4 24.13,12.84 24.13,11.75 23.81,11.43 R10.2
N$13
  Top 0: 12.06,11.75 17.46,11.75 arc71 19.68,13.34 arc52 19.37,15.88 arc46 18.41,16.51 arc-20 13.34,18.41
N$14
  Top 0.254: C5.1 R11.2 31.43,19.9 31.43,18.41 POT1.2
N$19  (via drill 0.2, 0.3)
  Top 0.254: Q1.1 38.37,58.74 36.83,58.74 36.2,59.37 v36.2,60.96
  Top 0.508: D3.A v23.81,59.05
  Bottom 0.508: J2.1 7.3,58.42 7.94,57.78 23.18,57.78 23.81,58.42 v23.81,59.05 23.81,59.69 25.08,60.96 v36.2,60.96 54.61,60.96 J1.20
N$21  (via drill 0.2)
  Top 0.254: U1.42 43.38,32.5 v43.5,32.38 | v23.18,45.72 23.18,49.21 | 23.18,49.21 23.18,49.53 | 23.18,49.53 22.86,49.53 | 22.86,49.53 R1.1 | R2.2 23.5,49.53 | 23.5,49.53 23.18,49.53 | 22.86,49.53 23.18,49.21 | 23.18,49.21 23.5,49.53
  Bottom 0.254: v43.5,32.38 43.5,42.55 40.96,45.09 23.81,45.09 v23.18,45.72
N$39
  Top 0.254: R15.1 D4.A
P-0  (via drill 0.2)
  Top 0.254: U1.14 22.02,29 v20.95,27.94 | J3.1 3.81,2.54 1.27,5.08 1.27,46.99 2.54,48.26 J2.5
  Bottom 0.254: v20.95,27.94 18.73,27.94 7.3,39.37 7.3,44.77 J2.5
P-1  (via drill 0.2)
  Top 0.254: U1.15 22.79,28.5 v21.59,27.3 | J3.7 20,0.95 8.26,0.95 7.62,1.59 7.62,3.49 1.91,9.21 1.91,45.09 2.54,45.72 J2.6
  Bottom 0.254: v21.59,27.3 21.27,26.99 18.73,26.99 6.67,39.05 6.67,42.86 J2.6
P-2  (via drill 0.2)
  Top 0.254: U1.16 23.68,28 v22.6,26.93
  Bottom 0.254: v22.6,26.93 22.03,26.35 18.41,26.35 6.03,38.73 6.03,40.96 J2.7 2.22,43.18 1.59,42.55 1.59,6.67 3.17,5.08 23.18,5.08 24.13,4.13 J3.8
P-3  (via drill 0.2)
  Top 0.254: U1.17 26.73,25.14 26.35,24.77 25.4,24.77 24.77,25.4 24.77,26.35 24.45,26.67 v23.5,26.67
  Bottom 0.254: v23.5,26.67 22.54,25.72 18.1,25.72 5.4,38.42 5.4,40.01 4.76,40.64 J2.8
P-4
  Top 0.254: U1.20 28.23,24.1 26.42,22.29 21.84,22.29 20.95,23.18 13.97,23.18 6.67,30.48 6.67,35.24 J2.9
P-5
  Top 0.254: U1.21 28.73,23.97 26.67,21.91 21.27,21.91 20.64,22.54 13.65,22.54 6.03,30.16 6.03,33.34 J2.10
P-6
  Top 0.254: U1.22 29.23,23.83 26.92,21.53 20.7,21.53 20.32,21.91 13.34,21.91 5.4,29.84 5.4,31.43 J2.11
P-7
  Top 0.254: U1.23 29.73,23.7 27.18,21.14 20.13,21.14 20,21.27 13.02,21.27 J2.12
P-8  (via drill 0.2)
  Top 0.254: U1.2 23.42,35 v22.86,35.56 | J3.2 8.89,3.81 6.99,5.71 6.99,25.4 4.45,27.94 J2.13
  Bottom 0.254: v22.86,35.56 22.86,34.92 19.37,31.43 19.37,30.48 22.23,27.62 23.5,27.62 24.45,26.67 24.45,24.45 22.54,22.54 13.97,22.54 8.57,27.94 J2.13
P-9  (via drill 0.2)
  Top 0.254: U1.8 21.2,32 v20.32,31.11 | J3.3 11.43,3.81 7.62,7.62 7.62,20.95 v9.68,23.02
  Bottom 0.254: v20.32,31.11 20.32,30.48 22.48,28.32 23.43,28.32 25.08,26.67 25.08,24.13 22.86,21.91 13.65,21.91 12.54,23.02 v9.68,23.02 7.3,25.4 J2.14
P-10  (via drill 0.2)
  Top 0.254: U1.9 21.98,31.5 v21.27,30.8 | J3.4 13.97,3.81 8.26,9.53 8.26,19.05 v10.48,21.27
  Bottom 0.254: v21.27,30.8 21.27,30.48 22.86,28.89 23.5,28.89 25.72,26.67 25.72,23.81 23.18,21.27 v10.48,21.27 8.57,21.27 6.99,22.86 J2.15
P-11  (via drill 0.2)
  Top 0.254: U1.10 22.75,31 v22.23,30.48 | J3.5 16.51,3.81 8.89,11.43 8.89,18.41 10.79,20.32 v11.11,20.32
  Bottom 0.254: v22.23,30.48 23.11,29.59 23.43,29.59 26.35,26.67 26.35,23.5 23.18,20.32 v11.11,20.32 J2.16
P-12  (via drill 0.2)
  Top 0.254: U1.11 24.15,30.5 v23.81,30.16 | J3.6 19.05,3.81 9.53,13.34 9.53,18.1 10.79,19.37 v11.75,19.37
  Bottom 0.254: v23.81,30.16 26.99,26.99 26.99,23.18 23.18,19.37 v11.75,19.37 10.16,17.78 J2.17
P-13  (via drill 0.2)
  Top 0.254: U1.24 30.23,23.56 27.43,20.77 17.91,20.77 v15.56,18.41
  Bottom 0.254: v15.56,18.41 12.38,15.24 J2.18
P-14  (via drill 0.2)
  Top 0.254: U1.25 30.73,23.43 27.69,20.38 18.8,20.38 v16.83,18.41
  Bottom 0.254: v16.83,18.41 11.11,12.7 J2.19
P-15  (via drill 0.2)
  Top 0.254: U1.26 31.23,23.29 27.94,20 19.68,20 v18.1,18.41
  Bottom 0.254: v18.1,18.41 9.84,10.16 J2.20
P-16
  Top 0.254: U1.37 39.53,30 45.72,23.81 45.72,20.32 55.88,10.16 J1.1
P-17  (via drill 0.2)
  Top 0.254: U1.38 40.3,30.5 46.67,24.13 v46.67,22.23 56.2,12.7 J1.2
  Bottom 0.254: v46.67,22.23 46.67,5.71 | J3.14 39.37,2.86 41.91,5.4 46.35,5.4
  Bottom 0.305: 46.35,5.4 46.67,5.71
P-18  (via drill 0.2)
  Top 0.254: U1.39 41.07,31 47.62,24.45 v47.62,22.86 55.24,15.24 J1.3
  Bottom 0.254: v47.62,22.86 47.62,5.71 46.67,4.76 43.81,4.76 41.91,2.86 J3.15
P-19  (via drill 0.2)
  Top 0.254: U1.40 41.84,31.5 v48.58,24.77 55.56,17.78 J1.4
  Bottom 0.254: v48.58,24.77 48.58,5.71 46.99,4.13 | J3.16 44.45,3.49 45.09,4.13
  Bottom 0.305: 45.09,4.13 46.99,4.13
P-20  (via drill 0.2)
  Top 0.254: U1.41 42.61,32 42.86,31.75 44.13,31.75 v49.21,26.67 55.56,20.32 J1.5
  Bottom 0.254: J3.17 46.99,2.86 49.21,5.08 v49.21,26.67
P-21
  Top 0.254: U1.43 36.15,33.02 45.4,33.02 55.56,22.86 J1.6
P-22
  Top 0.254: U1.50 33.73,38.49 35.24,40.01 48.26,40.01 49.21,39.05 49.21,31.75 55.56,25.4 J1.7
P-23
  Top 0.254: U1.53 32.23,39.85 34.29,41.91 50.16,41.91 51.12,40.96 51.12,32.38 55.56,27.94 J1.8
P-24
  Top 0.254: U1.54 31.73,40.3 33.97,42.55 50.8,42.55 51.75,41.59 51.75,34.29 55.56,30.48 J1.9
P-25
  Top 0.254: U1.55 31.23,40.76 33.66,43.18 51.44,43.18 52.39,42.23 52.39,36.2 55.56,33.02 J1.10
P-26
  Top 0.254: U1.56 30.73,41.21 33.34,43.81 52.07,43.81 53.02,42.86 53.02,38.1 55.56,35.56 J1.11
P-27
  Top 0.254: U1.57 30.23,41.66 33.02,44.45 52.7,44.45 53.66,43.5 53.66,40.01 55.56,38.1 J1.12
P-28
  Top 0.254: U1.58 29.73,42.11 32.7,45.09 53.34,45.09 54.29,44.13 54.29,41.91 55.56,40.64 J1.13
P-29
  Top 0.254: U1.59 29.23,42.56 32.38,45.72 53.98,45.72 54.93,44.77 54.93,43.81 55.56,43.18 J1.14
P-30
  Top 0.254: U1.61 28.23,43.47 31.43,46.67 54.61,46.67 55.56,45.72 J1.15
P-31
  Top 0.254: U1.62 27.73,43.92 32.07,48.26 J1.16
RX  (via drill 0.2)
  Top 0.254: U1.52 32.73,39.4 34.61,41.27 49.53,41.27 50.48,40.32 v50.48,31.75
  Bottom 0.254: v50.48,31.75 50.48,5.71 52.07,4.13 J3.19
SCK  (via drill 0.2)
  Top 0.254: J3.13 36.83,3.81 37.47,4.45 40.96,4.45 43.18,6.67 v43.18,23.18 | U1.34 37.86,28.5 v41.27,25.08
  Bottom 0.254: v41.27,25.08 v43.18,23.18
SCL
  Top 0.254: J3.9 26.67,4.76 28.89,6.99 39.69,6.99 40.64,7.94 40.64,20.64 39.69,21.59 34.29,21.59 32.73,23.15 U1.29
SDA
  Top 0.254: J3.10 29.21,4.45 31.11,6.35 40.01,6.35 41.27,7.62 41.27,21.27 40.32,22.23 34.61,22.23 33.23,23.6 U1.30
SWCLK  (via drill 0.2)
  Top 0.254: U1.49 34.23,38.04 35.56,39.37 v46.04,39.37
  Bottom 0.254: v46.04,39.37 46.04,46.67 48.9,49.53 J5.3
SWDIO  (via drill 0.2)
  Top 0.254: U1.46 41.17,34.5 41.59,34.92 v45.4,34.92
  Bottom 0.254: v45.4,34.92 45.4,46.99 46.35,47.94 J5.2
TX  (via drill 0.2)
  Top 0.254: U1.51 33.23,38.95 34.92,40.64 48.9,40.64 49.85,39.69 v49.85,32.38
  Bottom 0.254: v49.85,32.38 49.85,4.45 49.53,4.13 J3.18
USRBTN
  Top 0.254: U1.28 32.23,22.39 30.48,20.64 30.48,19.05 30.16,18.73 26.35,18.73 25.72,19.37 22.86,19.37 22.54,19.05 22.54,13.65 21.82,12.93 S1.2 20.95,12.84 20.95,11.75 21.27,11.43 C15.1
USRLED  (via drill 0.2)
  Top 0.254: D1.4 37.08,12.95 38.48,14.35 D1.2 39.05,14.62 v39.05,15.56 | v37.47,27.62 37.09,28 U1.33
  Bottom 0.254: v39.05,15.56 39.37,15.56 40.01,16.19 40.01,25.08 v37.47,27.62
VBUS  (via drill 0.3)
  Top 0.508: J4.B4 15.38,54.12 v13.97,52.7 | J4.A4 20.18,53.48 v20.32,53.34 | FB2.2 20.32,51.85
  Top 0.61: 20.32,51.85 v20.32,53.34
  Bottom 0.508: v20.32,53.34 19.68,52.7 v13.97,52.7
VFB
  Top 0.254: C13.2 37.15,55.24 | 37.15,55.24 R17.2 37.05,53.98 35.56,53.98 34.92,53.34 33.34,53.34 33.02,53.66 U3.6 | R16.1 39.27,55.24 37.15,55.24
VIN
  Top 0.508: U3.4 30.08,54.16 C8.1 29.11,54.71 26.99,56.83 D2.C D3.C
VUSB
  Top 0.305: U2.4 15.88,49.36 15.88,48.26 16.19,47.94 20,47.94 20.32,48.26 20.32,49.43 R1.2 20.32,49.63 20.32,50.16 20.64,50.48 26.04,50.48 26.35,50.8 F1.2
  Top 0.508: D2.A 24.75,55.05 R12.1 25.18,54.19 26.35,53.02 F1.2

### Text on the board
tPlace: +5V IN | +5V IN | +3.3V | +3.3V | !RST | GND | GND | PA0 | PB9 | PA1 | PB8 | PA2 | PB7 | PA3 | PB6 | PA4 | PB5 | PA5 | PB4 | PC14/15 32kOSC | PA6 | PH0/1 HFOSC | PB3 | PA7 | PD2 | PC13 | PC12 | PC0 | PA15 | PC1 | PA10 | PC2 | PA8 | PC3 | PC9 | PC4 | PC8 | PC5 | PC7 | PB0 | PC6 | STM32 uC-Board | S 2021 | PA0 | PC13 | PC0 | PC1 | PC2 | PC3 | PA1 | PA2 | PB10 | PB11 | PB15 | PB14 | PB13 | PC7 | PC8 | PC9 | PA8 | PC10 | PC11 | GND